# EAGLE design mayfly_peripheral_breakout (EAGLE 7.7.0)
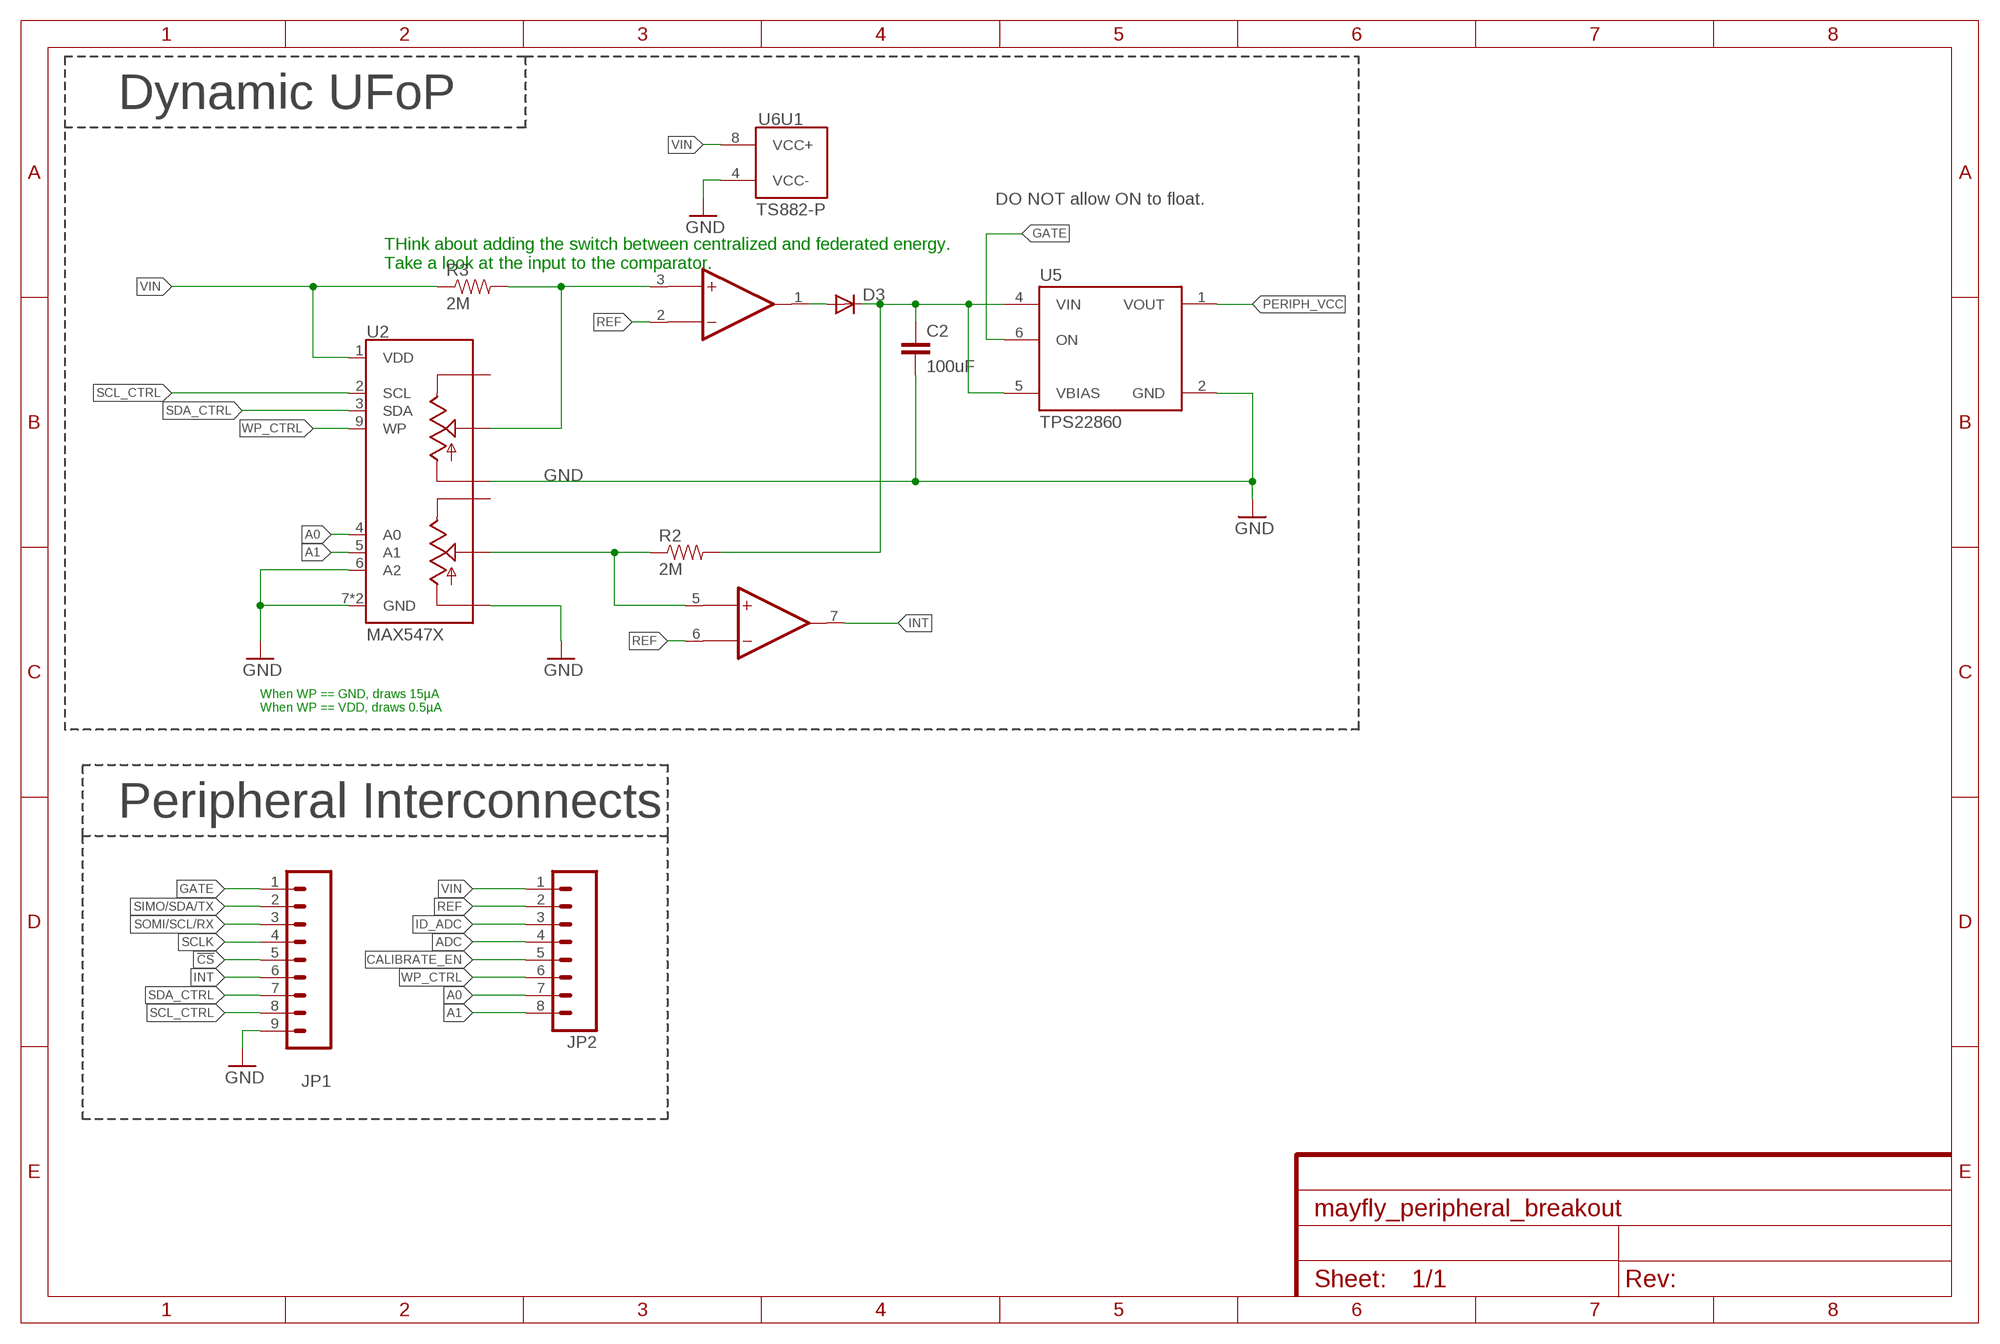
[diagram p0: schematic, sheet 1]
FRAME2 (FRAME-A4L): CNAME: Peripheral Connector Board; CREVISION: A; DESIGNER: Josiah Hester

## Parts
C2  100uF  CAP1210  [1210]
D3  DIODESOD  [SOD-323]
JP1  M09LOCK  [1X09_LOCK]
JP2  M08LOCK  [1X08_LOCK]
R2  2M  R-EU0603  [0603]
R3  2M  R-EU0603  [0603]
U2  MAX547X  [QFN16]
U5  TPS22860  [TSOT23-6]
U6  TS882-P  [UDFN8]

## Nets
!CS: JP1.5
A0: JP2.7 U2.4(A0)
A1: JP2.8 U2.5(A1)
ADC: JP2.4
CALIBRATE_EN: JP2.5
GATE: JP1.1 U5.6(ON)
GND: C2.2 JP1.9 U2.6(A2) U2.7(GND) U2.10(LB) U2.13(LA) U2.TH(GND) U5.2(GND) U6.4(U1:VCC-)
ID_ADC: JP2.3
INT: JP1.6 U6.7(OP2:OUT1)
N$1: D3.2(A) U6.1(OP1:OUT1)
N$2: C2.1 D3.1(C) R2.2 U5.4(VIN) U5.5(VBIAS)
N$4: R3.2 U2.14(WA) U6.3(OP1:IN1+)
N$5: R2.1 U2.11(WB) U6.5(OP2:IN1+)
PERIPH_VCC: U5.1(VOUT)
REF: JP2.2 U6.2(OP1:IN1-) U6.6(OP2:IN1-)
SCL_CTRL: JP1.8 U2.2(SCL)
SCLK: JP1.4
SDA_CTRL: JP1.7 U2.3(SDA)
SIMO/SDA/TX: JP1.2
SOMI/SCL/RX: JP1.3
VIN: JP2.1 R3.1 U2.1(VDD) U6.8(U1:VCC+)
WP_CTRL: JP2.6 U2.9(WP)
Unconnected: U2.12(HB) U2.15(HA)

## Notes on the sheet
- Dynamic UFoP
- DO NOT allow ON to float.
- THink about adding the switch between centralized and federated energy.
  Take a look at the input to the comparator.
- When WP == GND, draws 15µA
  When WP == VDD, draws 0.5µA
- Peripheral Interconnects

## Library data of the parts
C2 = SparkFun-Capacitors:CAP: Capacitor Standard 0603 ceramic capacitor, and 0.1" leaded capacitor.; DIGIKEY: 490-9969-1-ND
D3 = SparkFun-DiscreteSemi:DIODE: Diode These are standard reverse protection diodes and small signal diodes. SMA package can handle up to about 1A. SOD-323 can handle about 200mA. What the SOD-323 package when ordering, there are some mfgs out there that are 5-pin packages.; PROD_ID: DIO-09646
JP1 = SparkFun-Connectors:M09: Header 9 Standard 9-pin 0.1" header. Use with straight break away headers (SKU : PRT-00116), right angle break away headers (PRT-00553), swiss pins (PRT-00743), machine pins (PRT-00117), and female headers (PRT-00115).
JP2 = SparkFun-Connectors:M08: Header 8 Standard 8-pin 0.1" header. Use with straight break away headers (SKU : PRT-00116), right angle break away headers (PRT-00553), swiss pins (PRT-00743), machine pins (PRT-00117), and female headers (PRT-00115).
R2 = tiny_passives:R-EU; DIGIKEY: 311-2.00MHRCT-ND
R3 = tiny_passives:R-EU
U2 = max547x:MAX547X: MAXIM MAX547X: Dual, 256-Tap, Nonvolatile, I2C-Interface, Digital Potentiometers, 400nA Iq, 250µA 12ms write The MAX5477/MAX5478/MAX5479 nonvolatile, dual, linear-taper, digital potentiometers perform the function of a mechanical potentiometer, but replace the mechanics with a simple 2-wire digital interface. Each device performs the same function as a discrete potentiometer or variable resistor and has 256 tap points. The devices feature an internal, nonvolatile EEPROM used to store the wiper position for initialization during power-up. A write-protect feature prevents accidental overwrites of the EEPROM. The fast-mode I2C-compatible serial interface allows communication at data rates up to 400kbps, minimizing board space and reducing interconnection complexity in many applications. Three address inputs allow a total of eight unique address combinations.; DIGIKEY: MAX5479ETE+-ND
U5 = tps22860:TPS22860: TI: TPS22860 Ultra-Low Leakage Load Switch The TPS22860 is a small, ultra-low leakage current, single channel load switch. The device requires a VBIAS voltage and can operate over an input voltage range of 0 V to VBIAS. It can support a maximum continuous current of 200 mA. The switch is controlled by an on/off input (ON), which is capable of interfacing directly with low-voltage control signals. The TPS22860 is available in two small, space-saving 6-pin SOT-23 and SC70 packages. The device is characterized for operation over the free-air temperature range of –40°C to 85°C.; DIGIKEY: 296-43982-1-ND
U6 = ts882:TS882-P; DIGIKEY: 497-14073-1-ND

## Board
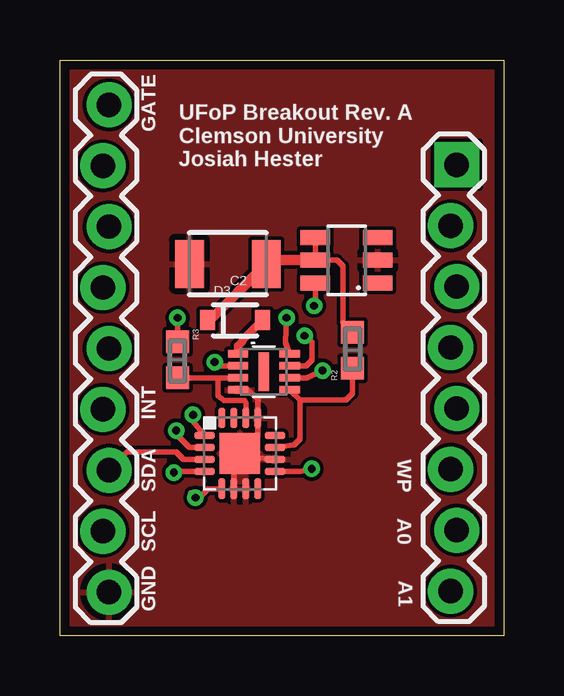
[diagram p1: board, top side]
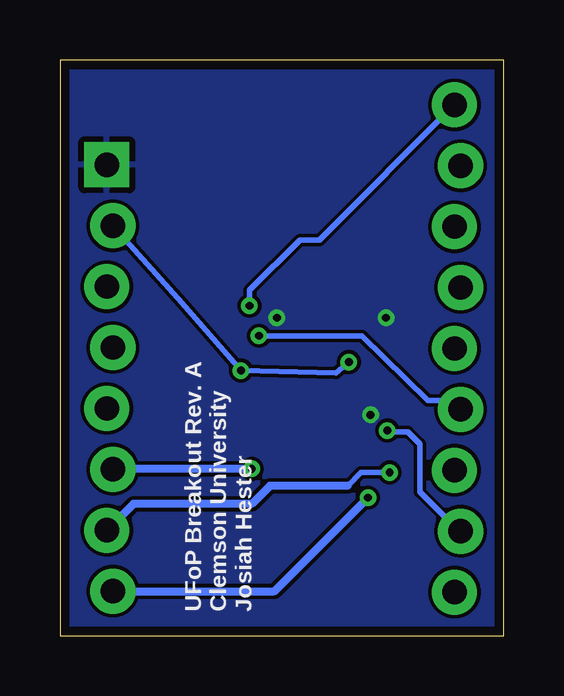
[diagram p2: board, bottom side, seen from below]

Size 18.5 x 24 mm. Coordinates in mm from the lower left corner, seen from the top.
Outline: 0,24 18.5,24 18.5,0 0,0 0,24
Copper layers (1*16): Top 0.0356mm / dielectric 1.5011mm / Bottom 0.0356mm
Design rules "LaenPCBOrder": minimum track width 6mil, minimum drill 13mil, track to track 6mil, track to pad 6mil, pad to pad 6mil, via to via 6mil, smd to smd 6mil, copper to edge 15mil, drill to drill 6mil, minimum pad ring 7mil, minimum via ring 7mil, stop-mask expansion 3mil, vias tented up to drill 0mil, thermal gap 10mil

### Footprints (pad centres in the part's own frame; a part is rotated, then mirrored left to right if it is on the bottom)
1210 = smd 1.2 x 2: 1 -1.6,0; 2 1.6,0
SOD-323 = smd 0.63 x 0.83: 1 -1.15,0; 2 1.15,0
1X09_LOCK = drill 1.016 pad 1.88: 1 0,0.127; 2 2.54,-0.127; 3 5.08,0.127; 4 7.62,-0.127; 5 10.16,0.127; 6 12.7,-0.127; 7 15.24,0.127; 8 17.78,-0.127; 9 20.32,0.127
1X08_LOCK = drill 1.016 pad 1.88 square: 1 0,0.127 | drill 1.016 pad 1.88: 2 2.54,-0.127; 3 5.08,0.127; 4 7.62,-0.127; 5 10.16,0.127; 6 12.7,-0.127; 7 15.24,0.127; 8 17.78,-0.127
0603 = smd 0.95 x 0.95: 1 -0.75,0; 2 0.75,0
QFN16 = smd 0.85 x 0.3: 1 -1.475,0.75; 2 -1.475,0.25; 3 -1.475,-0.25; 4 -1.475,-0.75; 9 1.475,-0.75; 10 1.475,-0.25; 11 1.475,0.25; 12 1.475,0.75 | smd 0.3 x 0.85: 5 -0.75,-1.475; 6 -0.25,-1.475; 7 0.25,-1.475; 8 0.75,-1.475; 13 0.75,1.475; 14 0.25,1.475; 15 -0.25,1.475; 16 -0.75,1.475 | smd 1.7 x 1.7: TH 0,0
TSOT23-6 = smd 0.62 x 1.22: 1 -0.95,-1.3; 2 0,-1.3; 3 0.95,-1.3; 4 0.95,1.3; 5 0,1.3; 6 -0.95,1.3
UDFN8 = smd 0.3 x 0.85: 1 -0.75,-1.075; 2 -0.25,-1.075; 3 0.25,-1.075; 4 0.75,-1.075; 5 0.75,1.075; 6 0.25,1.075; 7 -0.25,1.075; 8 -0.75,1.075 | smd 1.6 x 0.45: TH 0,0

### Placement (x,y rotation side)
C2  7,15.5 180 top
D3  7.3,13.15 0 top
JP1  1.92,22.13 270 top
JP2  16.42,19.63 270 top
R2  12.2,11.9 90 top
R3  4.9,11.5 270 top
U2  7.5,7.6 0 top
U5  11.95,15.65 90 top
U6  8.5,11 270 top

### Tracks (layer width: path | path; a pad name or v marks a point on that pad's centre or on a via)
A0  (via drill 0.33)
  Top 0.222: v4.75,6.8 4.8,6.85 U2.4
  Bottom 0.222: 6.5,6.25 5.95,6.8 v4.75,6.8
  Bottom 0.333: 6.5,6.25 9.75,6.25 10.5,5.5 15.44,5.5 JP2.7
A1  (via drill 0.33)
  Top 0.222: v5.65,5.75 5.45,5.95 5.8,5.75 6.17,6.12 U2.5
  Bottom 0.333: JP2.8 9.55,1.85 v5.65,5.75
GATE  (via drill 0.33)
  Top 0.222: U5.6 10.65,14.15 v10.6,13.75
  Bottom 0.222: v10.6,13.75 10.6,14.4 8.5,16.5 7.68,16.5 JP1.1
GND
  Top 0.222: U2.10 7.75,7.45 U2.TH | U2.TH 8.25,8.45 U2.13 8.25,9.85 7.85,10.25 U6.4 | U2.6 7.25,7.45 U2.TH
  pour Top: -0.5,0 19,0 19,24 -0.5,24
INT  (via drill 0.33)
  Top 0.222: U6.7 10.25,11.25 10.5,11.5 10.5,12.25 v10.2,12.5
  Bottom 0.222: v10.2,12.5 5.9,12.5 3.15,9.8 2.16,9.8 JP1.6
N$1
  Top 0.333: U6.1 7.42,12.07 7.6,12.25 7.6,12.3 D3.2
N$2
  Top 0.222: U5.4 U5.5 11.55,15.65 11.8,15.4 11.8,13.05 R2.2
  Top 0.406: D3.1 6.25,13.15 7.42,14.32
  Top 0.44: U5.5 8.75,15.65 C2.1 7.42,14.32
N$4
  Top 0.222: U6.3 6.6,10.75 | 6.6,10.75 R3.2 | U2.14 7.75,9.7 7.7,9.8 6.85,9.8 6.6,10 6.6,10.75
N$5
  Top 0.222: U2.11 9.75,7.95 10,8.2 10,9.82 | 10,9.82 U6.5 | 10,9.82 11.93,9.82 12.2,10.1 R2.1
REF  (via drill 0.33)
  Top 0.222: v10.95,11.05 10.3,10.75 U6.6 | U6.2 6.6,11.25 v6.45,11.4
  Bottom 0.222: JP2.2 13.41,13.86 v10.95,11.05 7,10.95 v6.45,11.4
SCL_CTRL  (via drill 0.33)
  Top 0.222: v4.85,8.55 4.7,8.55 5.4,7.85 U2.2
  Bottom 0.222: JP1.8 1.85,4.35 3.5,6 3.5,8 4,8.5 4.8,8.5 v4.85,8.55
SDA_CTRL
  Top 0.222: U2.3 5.15,7.35 4.85,7.65 2.81,7.65 JP1.7
VIN  (via drill 0.33)
  Top 0.222: v5.55,9.2 5.55,8.93 U2.1 | U6.8 9.4,12.22 v9.45,13.25 | R3.1 v4.9,13.25
  pour Bottom: -0.5,0 19,0 19,24 -0.5,24
WP_CTRL  (via drill 0.33)
  Top 0.222: U2.9 10,6.85 v10.5,6.95
  Bottom 0.333: v10.5,6.95 16.27,6.95 JP2.6

### Text on the board
tPlace: GATE | UFoP Breakout Rev. A / Clemson University / Josiah Hester | INT | WP | SDA | A0 | SCL | A1 | GND
bPlace: UFoP Breakout Rev. A / Clemson University / Josiah Hester